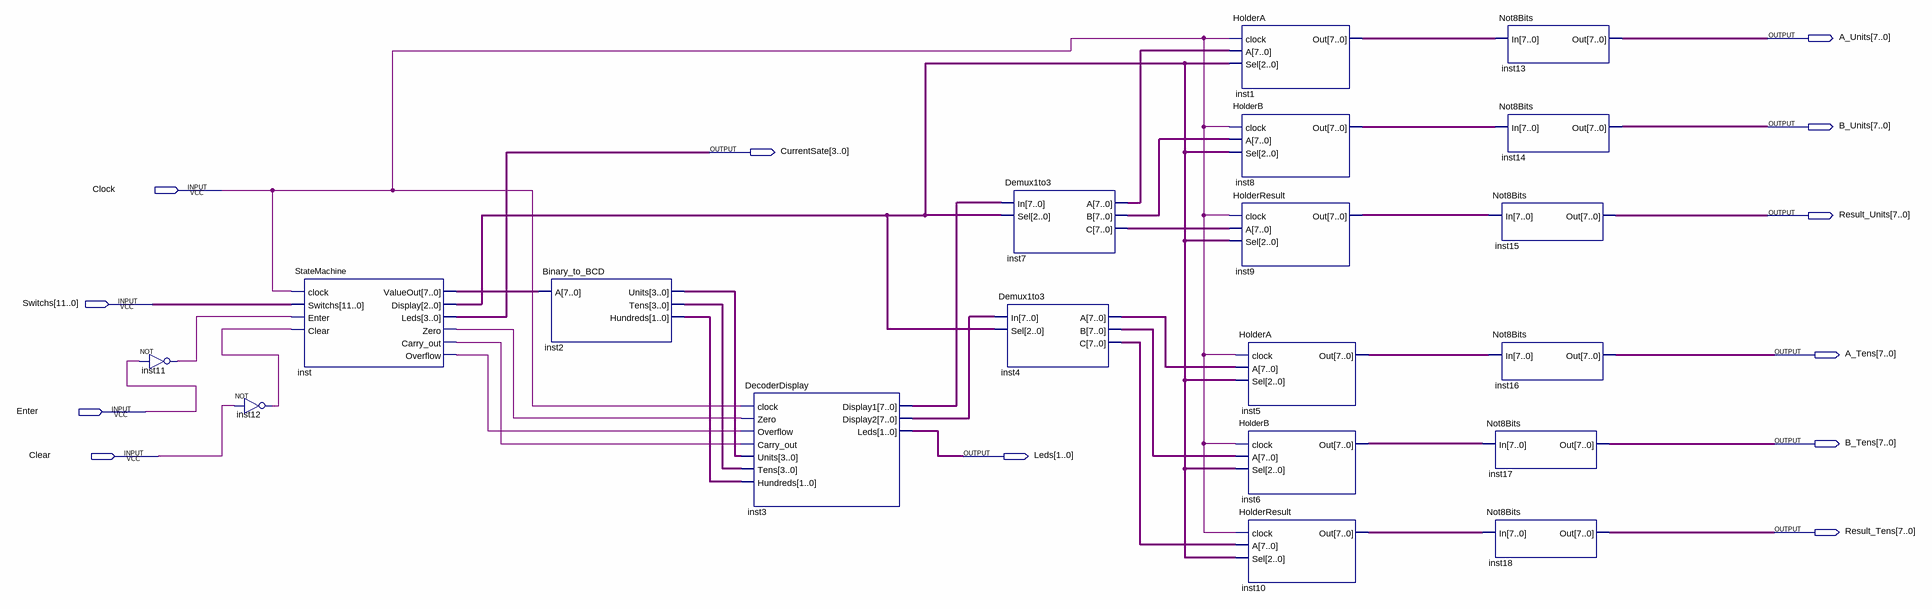
[diagram p0: schematic sheet]
// Quartus schematic CalculatorSchematic.bdf as structural Verilog: 19 symbols, 12 pins
module CalculatorSchematic (
  input  Clock,
  input  [11:0] Switchs,
  input  Enter,
  input  Clear,
  output [7:0] A_Units,
  output [7:0] B_Units,
  output [3:0] CurrentSate,
  output [7:0] Result_Units,
  output [7:0] A_Tens,
  output [7:0] B_Tens,
  output [1:0] Leds,
  output [7:0] Result_Tens
);

  wire inst11_out, inst12_out, inst_carry_out, inst_overflow, inst_zero;
  wire [1:0] inst2_hundreds;
  wire [2:0] inst_display;
  wire [3:0] inst2_tens, inst2_units;
  wire [7:0] inst1_out, inst3_display1, inst3_display2, inst4_a, inst4_b, inst4_c, inst5_out, inst6_out,
       inst7_a, inst7_b, inst7_c, inst8_out, inst9_out, inst10_out, inst_valueout;

  not inst11 (inst11_out, Enter);
  not inst12 (inst12_out, Clear);
  StateMachine inst (
    .clock(Clock), .Switchs(Switchs), .Enter(inst11_out), .Clear(inst12_out), .ValueOut(inst_valueout),
    .Display(inst_display), .Leds(CurrentSate), .Zero(inst_zero), .Carry_out(inst_carry_out),
    .Overflow(inst_overflow));
  Binary_to_BCD inst2 (.A(inst_valueout), .Units(inst2_units), .Tens(inst2_tens), .Hundreds(inst2_hundreds));
  DecoderDisplay inst3 (
    .clock(Clock), .Zero(inst_zero), .Overflow(inst_overflow), .Carry_out(inst_carry_out),
    .Units(inst2_units), .Tens(inst2_tens), .Hundreds(inst2_hundreds), .Display1(inst3_display1),
    .Display2(inst3_display2), .Leds(Leds));
  Demux1to3 inst4 (.In(inst3_display2), .Sel(inst_display), .A(inst4_a), .B(inst4_b), .C(inst4_c));
  Demux1to3 inst7 (.In(inst3_display1), .Sel(inst_display), .A(inst7_a), .B(inst7_b), .C(inst7_c));
  HolderA inst1 (.clock(Clock), .A(inst7_a), .Sel(inst_display), .Out(inst1_out));
  HolderB inst8 (.clock(Clock), .A(inst7_b), .Sel(inst_display), .Out(inst8_out));
  HolderResult inst9 (.clock(Clock), .A(inst7_c), .Sel(inst_display), .Out(inst9_out));
  HolderA inst5 (.clock(Clock), .A(inst4_a), .Sel(inst_display), .Out(inst5_out));
  HolderB inst6 (.clock(Clock), .A(inst4_b), .Sel(inst_display), .Out(inst6_out));
  HolderResult inst10 (.clock(Clock), .A(inst4_c), .Sel(inst_display), .Out(inst10_out));
  Not8Bits inst13 (.In(inst1_out), .Out(A_Units));
  Not8Bits inst14 (.In(inst8_out), .Out(B_Units));
  Not8Bits inst15 (.In(inst9_out), .Out(Result_Units));
  Not8Bits inst16 (.In(inst5_out), .Out(A_Tens));
  Not8Bits inst17 (.In(inst6_out), .Out(B_Tens));
  Not8Bits inst18 (.In(inst10_out), .Out(Result_Tens));
endmodule
